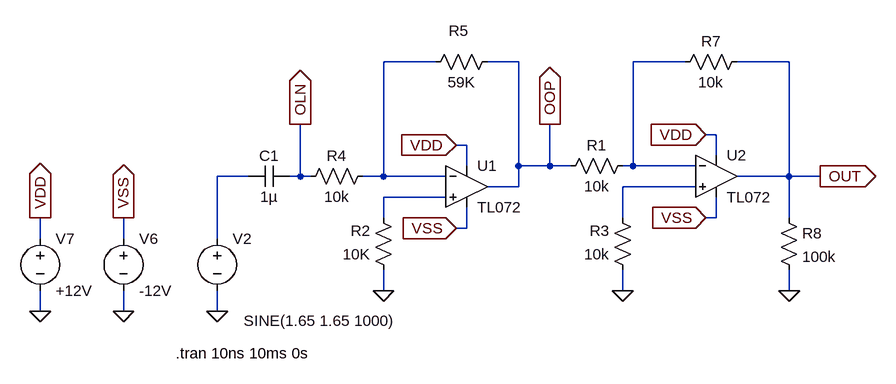
[diagram p0: schematic phr-eurpi-ext-05.asc]
phr-eurpi-ext-05.asc, the LTspice schematic file:
Version 4
SHEET 1 1100 680
WIRE 416 48 336 48
WIRE 544 48 496 48
WIRE 800 48 720 48
WIRE 960 48 880 48
WIRE 848 160 832 160
WIRE 464 176 448 176
WIRE 848 192 848 160
WIRE 464 208 464 176
WIRE 544 208 544 48
WIRE 592 208 592 144
WIRE 592 208 544 208
WIRE 624 208 592 208
WIRE 720 208 720 48
WIRE 720 208 704 208
WIRE 816 208 720 208
WIRE 128 224 80 224
WIRE 208 224 208 144
WIRE 208 224 192 224
WIRE 224 224 208 224
WIRE 336 224 336 48
WIRE 336 224 304 224
WIRE 432 224 336 224
WIRE 960 224 960 48
WIRE 960 224 880 224
WIRE 1008 224 960 224
WIRE 544 240 544 208
WIRE 544 240 496 240
WIRE 816 240 704 240
WIRE 432 256 336 256
WIRE 336 288 336 256
WIRE 704 288 704 240
WIRE 848 288 848 256
WIRE 848 288 832 288
WIRE 960 288 960 224
WIRE 464 304 464 272
WIRE 464 304 448 304
WIRE -192 320 -192 288
WIRE -64 320 -64 288
WIRE 80 320 80 224
WIRE 336 400 336 368
WIRE 704 400 704 368
WIRE 960 400 960 368
WIRE -192 432 -192 400
WIRE -64 432 -64 400
WIRE 80 432 80 400
FLAG 80 432 0
FLAG 336 400 0
FLAG 704 400 0
FLAG 960 400 0
FLAG -64 432 0
FLAG -192 432 0
FLAG 448 304 VSS
IOPIN 448 304 In
FLAG 448 176 VDD
IOPIN 448 176 In
FLAG 832 288 VSS
IOPIN 832 288 In
FLAG 832 160 VDD
IOPIN 832 160 In
FLAG -192 288 VDD
IOPIN -192 288 Out
FLAG -64 288 VSS
IOPIN -64 288 Out
FLAG 1008 224 OUT
IOPIN 1008 224 Out
FLAG 592 144 OOP
IOPIN 592 144 Out
FLAG 208 144 OLN
IOPIN 208 144 Out
SYMBOL OpAmps/TL072 464 176 R0
SYMATTR InstName U1
SYMBOL Voltage 80 304 R0
WINDOW 3 41 142 Left 2
SYMATTR Value SINE(1.65 1.65 1000)
SYMATTR InstName V2
SYMBOL Res 352 384 R180
WINDOW 0 36 76 Left 2
WINDOW 3 36 40 Left 2
SYMATTR InstName R2
SYMATTR Value 10K
SYMBOL Res 320 208 R90
WINDOW 0 0 56 VBottom 2
WINDOW 3 32 56 VTop 2
SYMATTR InstName R4
SYMATTR Value 10k
SYMBOL Res 512 32 R90
WINDOW 0 -16 60 VBottom 2
WINDOW 3 32 56 VTop 2
SYMATTR InstName R5
SYMATTR Value 59K
SYMBOL Cap 192 208 R90
WINDOW 0 0 32 VBottom 2
WINDOW 3 32 32 VTop 2
SYMATTR InstName C1
SYMATTR Value 1µ
SYMBOL OpAmps/TL072 848 160 R0
SYMATTR InstName U2
SYMBOL Res 720 192 R90
WINDOW 0 0 56 VBottom 2
WINDOW 3 32 56 VTop 2
SYMATTR InstName R1
SYMATTR Value 10k
SYMBOL Res 720 384 R180
WINDOW 0 36 76 Left 2
WINDOW 3 36 40 Left 2
SYMATTR InstName R3
SYMATTR Value 10k
SYMBOL Res 896 32 R90
WINDOW 0 0 56 VBottom 2
WINDOW 3 32 56 VTop 2
SYMATTR InstName R7
SYMATTR Value 10k
SYMBOL Res 944 272 R0
SYMATTR InstName R8
SYMATTR Value 100k
SYMBOL Voltage -64 304 R0
SYMATTR InstName V6
SYMATTR Value -12V
SYMBOL Voltage -192 304 R0
SYMATTR InstName V7
SYMATTR Value +12V
TEXT 16 496 Left 2 !.tran 10ns 10ms 0s

The netlist it stands for:
* phr-eurpi-ext-05.asc
XU1 N005 N001 VDD VSS OOP TL072  ; pins In+ In- V+ V- OUT
V2 N003 0 SINE(1.65 1.65 1000)
R2 0 N005 10K
R4 N001 OLN 10k
R5 OOP N001 59K
C1 OLN N003 1µ
XU2 N004 N002 VDD VSS OUT TL072  ; pins In+ In- V+ V- OUT
R1 N002 OOP 10k
R3 0 N004 10k
R7 OUT N002 10k
R8 OUT 0 100k
V6 VSS 0 -12V
V7 VDD 0 +12V
.tran 10ns 10ms 0s
.backanno
.end